# EAGLE design FullInstrument (EAGLE 7.4.0)
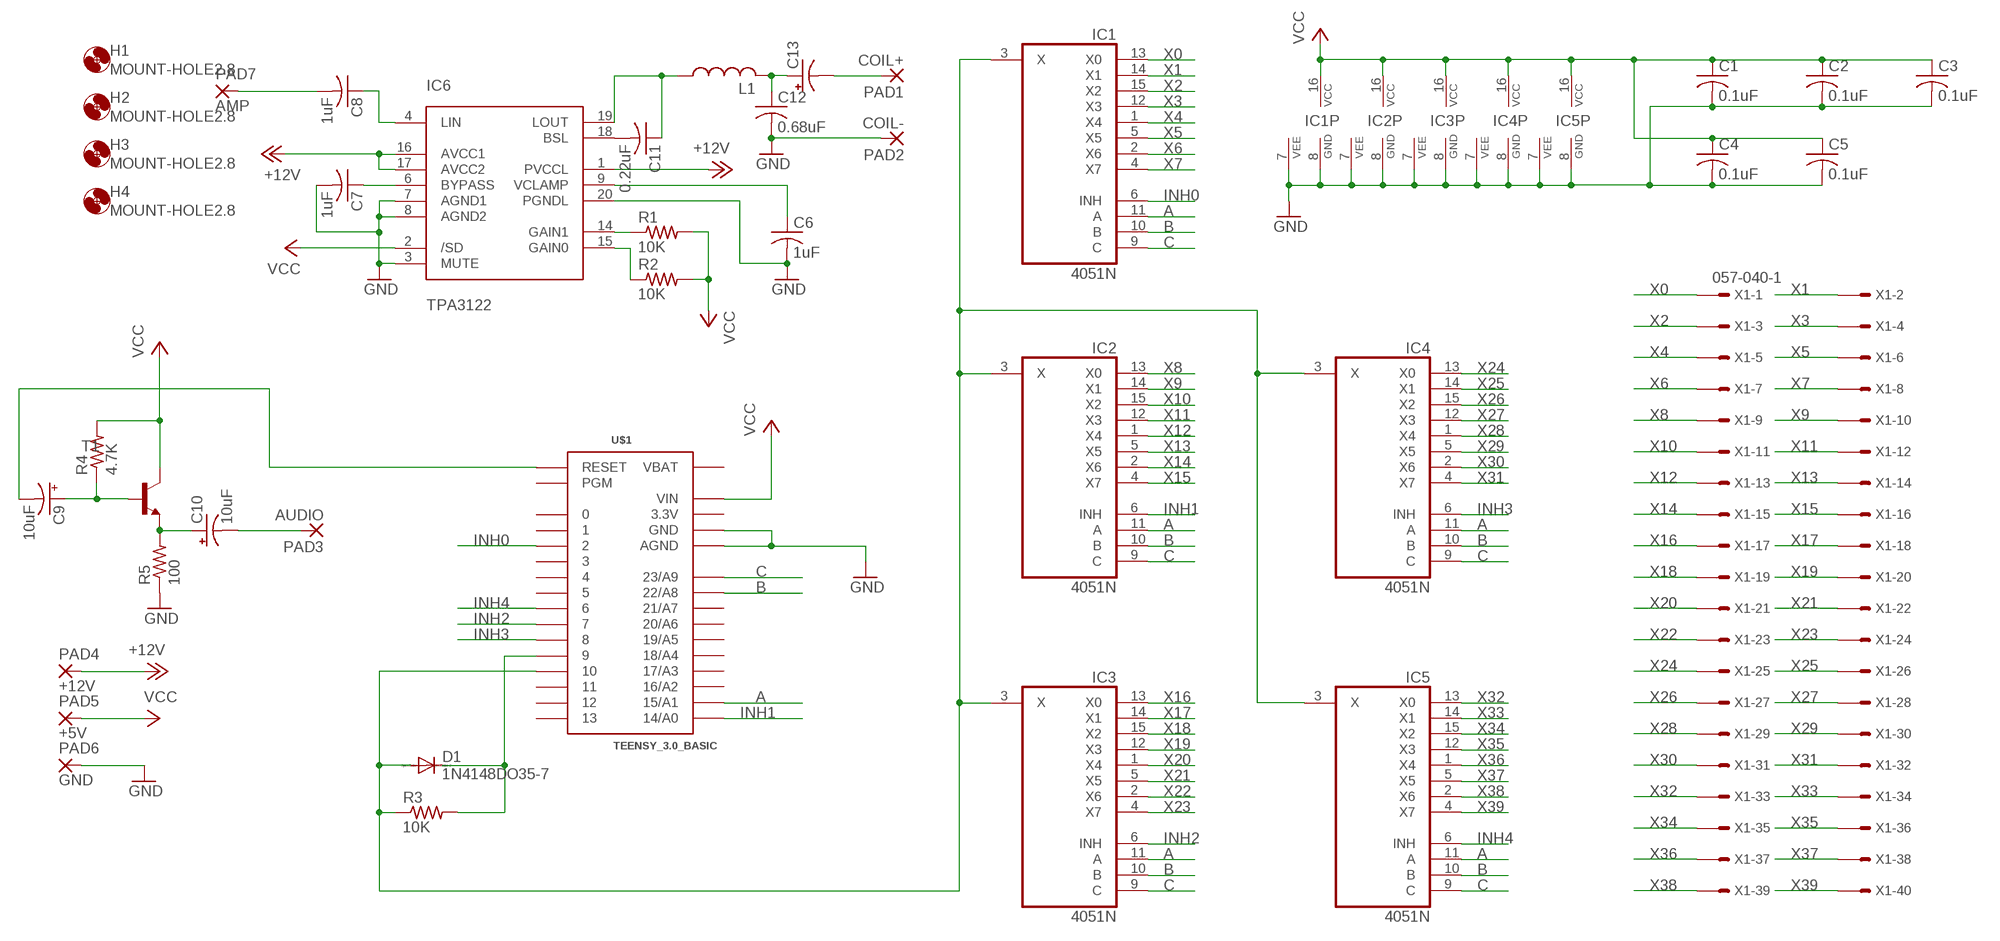
[diagram p0: schematic, sheet 1]

## Parts
C1  0.1uF  C-US025-025X050  [C025-025X050]
C2  0.1uF  C-US025-025X050  [C025-025X050]
C3  0.1uF  C-US025-025X050  [C025-025X050]
C4  0.1uF  C-US025-025X050  [C025-025X050]
C5  0.1uF  C-US025-025X050  [C025-025X050]
C6  1uF  C-US050-025X075  [C050-025X075]
C7  1uF  C-US050-025X075  [C050-025X075]
C8  1uF  C-US050-025X075  [C050-025X075]
C9  10uF  CPOL-USE2-5  [E2-5]
C10  10uF  CPOL-USE2-5  [E2-5]
C11  0.22uF  C-US050-025X075  [C050-025X075]
C12  0.68uF  C-US050-025X075  [C050-025X075]
C13  CPOL-USE5-8.5  [E5-8,5]
D1  1N4148DO35-7  [DO35-7]
H1  MOUNT-HOLE2.8  [2,8]
H2  MOUNT-HOLE2.8  [2,8]
H3  MOUNT-HOLE2.8  [2,8]
H4  MOUNT-HOLE2.8  [2,8]
IC1  4051N  [DIL16]
IC2  4051N  [DIL16]
IC3  4051N  [DIL16]
IC4  4051N  [DIL16]
IC5  4051N  [DIL16]
IC6  TPA3122  [TPA3122-DIP20]
L1  L-US6000-XXX-RC  [6000-XXXX-RC]
PAD1  COIL+  3,17/1,3  [3,17/1,3]
PAD2  COIL-  3,17/1,3  [3,17/1,3]
PAD3  AUDIO  3,17/1,3  [3,17/1,3]
PAD4  +12V  3,17/1,3  [3,17/1,3]
PAD5  +5V  3,17/1,3  [3,17/1,3]
PAD6  GND  3,17/1,3  [3,17/1,3]
PAD7  AMP  3,17/1,3  [3,17/1,3]
R1  10K  R-US_0204/2V  [0204V]
R2  10K  R-US_0204/2V  [0204V]
R3  10K  R-US_0204/2V  [0204V]
R4  4.7K  R-US_0204/2V  [0204V]
R5  100  R-US_0204/2V  [0204V]
T1  -NPN-TO92-EBC  [TO92-EBC]
U$1  TEENSY_3.0_BASIC  [TEENSY_3.0_BASIC]
X1  057-040-1  [057-040-1]

## Nets
+12V: IC6.1(PVCCL) IC6.16(AVCC1) IC6.17(AVCC2) PAD4.1(P)
A: IC1.11(A) IC2.11(A) IC3.11(A) IC4.11(A) IC5.11(A) U$1.15/A1
B: IC1.10(B) IC2.10(B) IC3.10(B) IC4.10(B) IC5.10(B) U$1.22/A8
C: IC1.9(C) IC2.9(C) IC3.9(C) IC4.9(C) IC5.9(C) U$1.23/A9
GND [ground]: C1.2 C2.2 C3.2 C4.2 C5.2 C6.2 C7.2 C12.2 IC1.7(VEE) IC1.8(GND) IC2.7(VEE) IC2.8(GND) IC3.7(VEE) IC3.8(GND) IC4.7(VEE) IC4.8(GND) IC5.7(VEE) IC5.8(GND) IC6.3(MUTE) IC6.7(AGND1) IC6.8(AGND2) IC6.20(PGNDL) PAD2.1(P) PAD6.1(P) R5.1 U$1.AGND U$1.GND U$1.GND1(GND)
INH0: IC1.6(INH) U$1.2
INH1: IC2.6(INH) U$1.14/A0
INH2: IC3.6(INH) U$1.7
INH3: IC4.6(INH) U$1.8
INH4: IC5.6(INH) U$1.6
N$1: IC6.14(GAIN1) R1.1
N$2: C11.2 IC6.18(BSL)
N$3: IC6.15(GAIN0) R2.1
N$4: C8.1 IC6.4(LIN)
N$5: C7.1 IC6.6(BYPASS)
N$6: C6.1 IC6.9(VCLAMP)
N$7: R3.2 U$1.9
N$8: D1.A IC1.3(X) IC2.3(X) IC3.3(X) IC4.3(X) IC5.3(X) R3.1 U$1.10
N$9: C10.+ R5.2 T1.E
N$10: C9.+ R4.1 T1.B
N$11: C11.1 IC6.19(LOUT) L1.1
N$12: C9.- U$1.RESET
N$13: C12.1 C13.+ L1.2
N$14: C13.- PAD1.1(P)
N$15: C10.- PAD3.1(P)
N$16: C8.2 PAD7.1(P)
VCC [ground]: C1.1 C2.1 C3.1 C4.1 C5.1 IC1.16(VCC) IC2.16(VCC) IC3.16(VCC) IC4.16(VCC) IC5.16(VCC) IC6.2(/SD) PAD5.1(P) R1.2 R2.2 R4.2 T1.C U$1.VIN
X0: IC1.13(X0) X1.1
X1: IC1.14(X1) X1.2
X2: IC1.15(X2) X1.3
X3: IC1.12(X3) X1.4
X4: IC1.1(X4) X1.5
X5: IC1.5(X5) X1.6
X6: IC1.2(X6) X1.7
X7: IC1.4(X7) X1.8
X8: IC2.13(X0) X1.9
X9: IC2.14(X1) X1.10
X10: IC2.15(X2) X1.11
X11: IC2.12(X3) X1.12
X12: IC2.1(X4) X1.13
X13: IC2.5(X5) X1.14
X14: IC2.2(X6) X1.15
X15: IC2.4(X7) X1.16
X16: IC3.13(X0) X1.17
X17: IC3.14(X1) X1.18
X18: IC3.15(X2) X1.19
X19: IC3.12(X3) X1.20
X20: IC3.1(X4) X1.21
X21: IC3.5(X5) X1.22
X22: IC3.2(X6) X1.23
X23: IC3.4(X7) X1.24
X24: IC4.13(X0) X1.25
X25: IC4.14(X1) X1.26
X26: IC4.15(X2) X1.27
X27: IC4.12(X3) X1.28
X28: IC4.1(X4) X1.29
X29: IC4.5(X5) X1.30
X30: IC4.2(X6) X1.31
X31: IC4.4(X7) X1.32
X32: IC5.13(X0) X1.33
X33: IC5.14(X1) X1.34
X34: IC5.15(X2) X1.35
X35: IC5.12(X3) X1.36
X36: IC5.1(X4) X1.37
X37: IC5.5(X5) X1.38
X38: IC5.2(X6) X1.39
X39: IC5.4(X7) X1.40
Unconnected: D1.C U$1.0 U$1.1 U$1.3 U$1.4 U$1.5 U$1.11 U$1.12 U$1.13 U$1.16/A2 U$1.17/A3 U$1.18/A4 U$1.19/A5 U$1.20/A6 U$1.21/A7 U$1.PGM

## Power pins joined to a net without a drawn wire
3.3V: U$1.3.3V U$1.3.3V1(3.3V)
VBAT: U$1.VBAT

## Library data of the parts
C1-C8 C11 C12 = rcl:C-US: CAPACITOR, American symbol
C9 C10 C13 = rcl:CPOL-US: POLARIZED CAPACITOR, American symbol
D1 = diode:1N4148: DIODE high speed (Philips)
H1-H4 = holes:MOUNT-HOLE: MOUNTING HOLE with drill center marker
IC1-IC5 = 40xx:4051: 8-channel ANALOG MULTIPLEXER
IC6 = tpa3122:TPA3122
L1 = rcl:L-US: INDUCTOR, American symbol
PAD1-PAD7 = wirepad:3,17/1,3: THROUGH-HOLE PAD
R1-R5 = rcl:R-US_: RESISTOR, American symbol
T1 = transistor:*-NPN-: NPN Transistror BF959 corrected 2008.03.06
U$1 = Teensy3.0:TEENSY_3.0_BASIC: Basic Teensy 3.0 with none of the 'inner' pins enabled. See '+4', 'AllAnalogPins", and 'AllPins' packages for additional pin holes, as needed.
X1 = con-panduit:057-040-: CONNECTOR 40-pin series 057 contact pc board low profile headers; OC_FARNELL: unknown; OC_NEWARK: unknown

## Net classes
0 default: width 0.203 mm
1 ground: width 0.406 mm

## Board
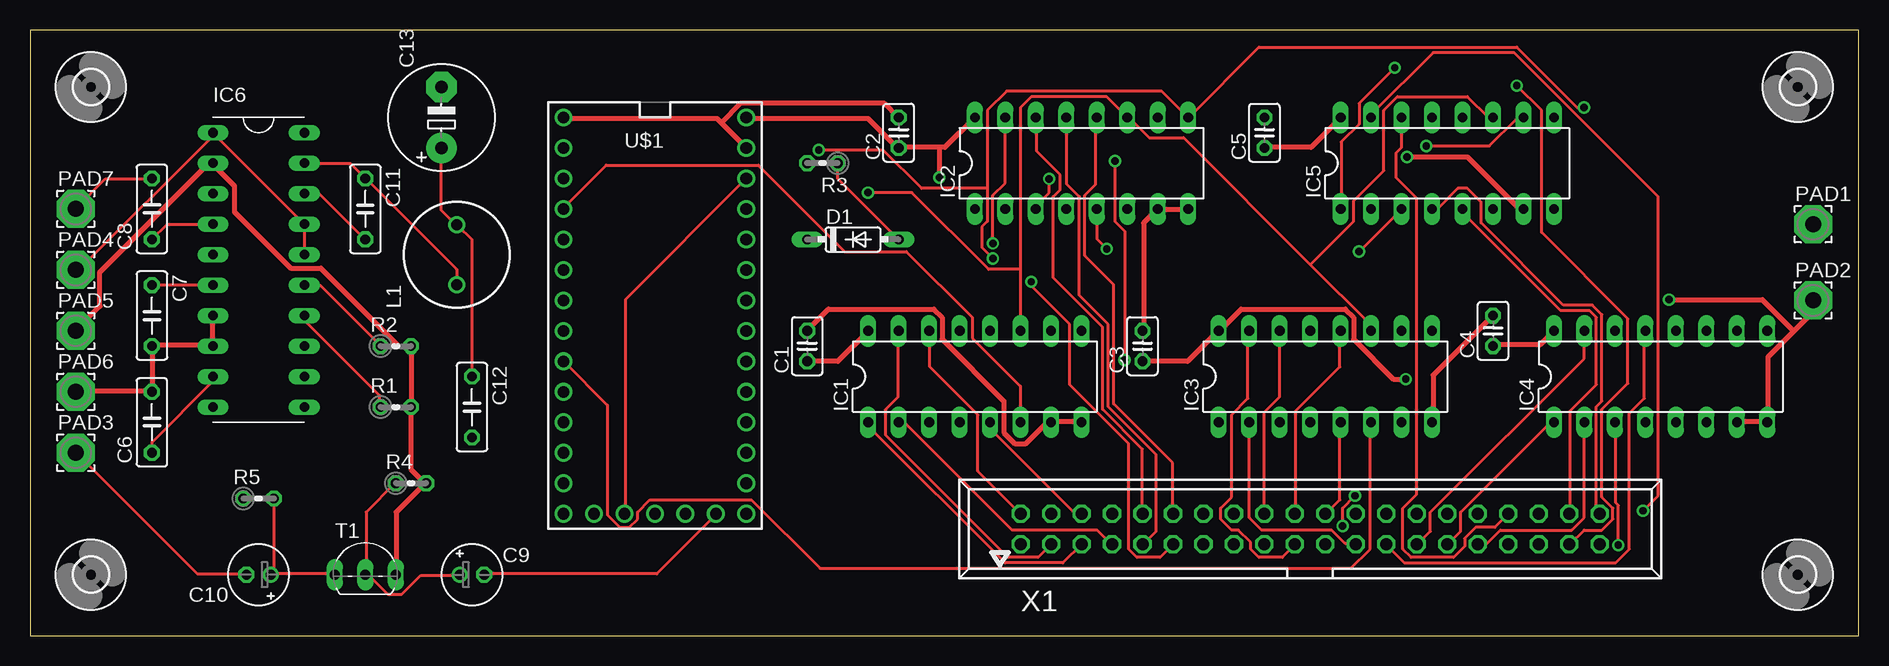
[diagram p1: board, top side]
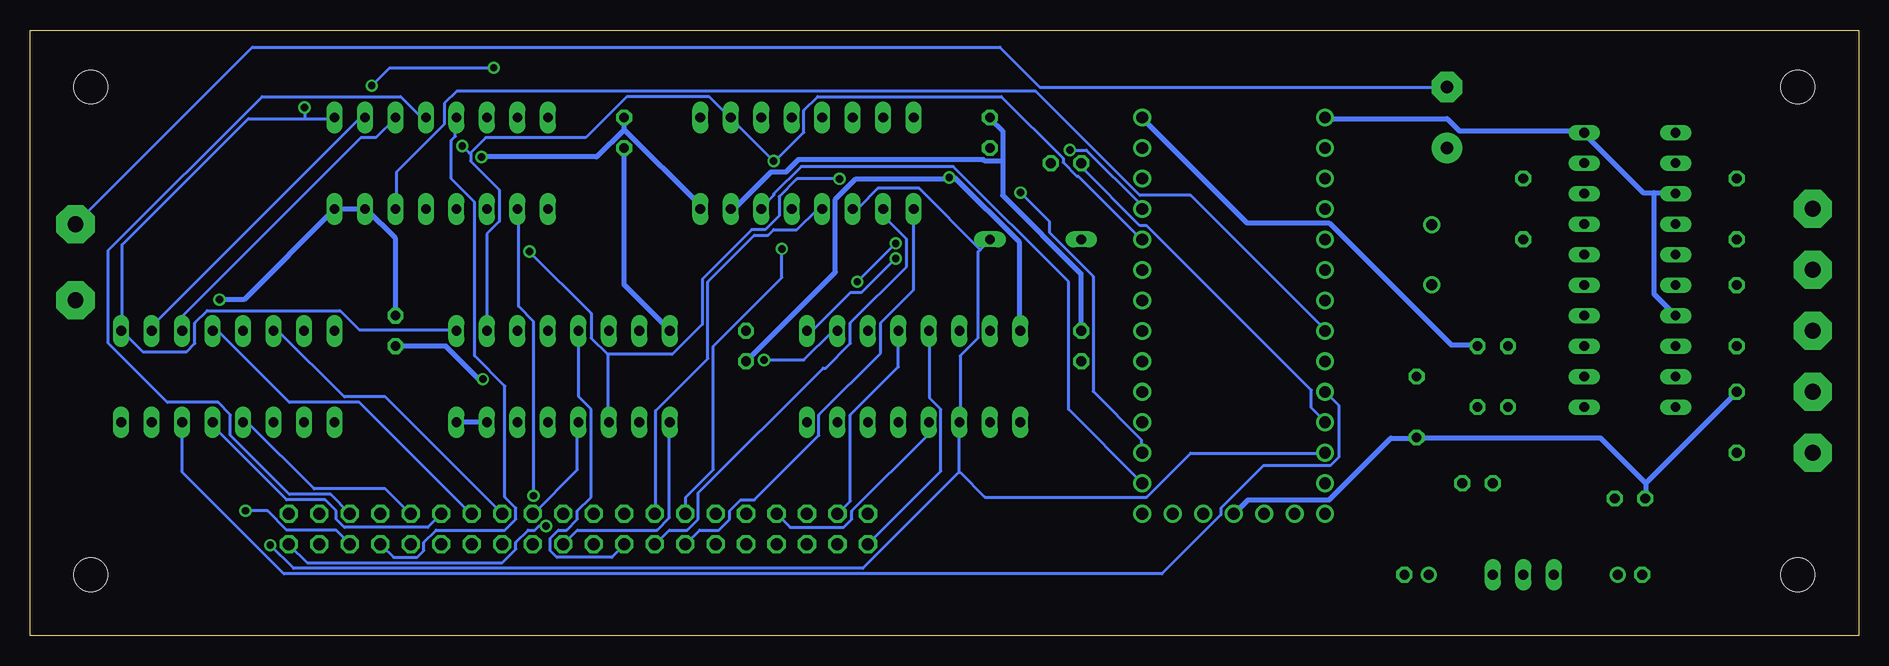
[diagram p2: board, bottom side, seen from below]

Size 152.38 x 50.47 mm. Coordinates in mm from the lower left corner, seen from the top.
Outline: 0,0 152.38,0 152.38,50.47 0,50.47 0,0
Copper layers (1*16): Top 0.035mm / dielectric 1.5mm / Bottom 0.035mm
Design rules "default": minimum track width 10mil, minimum drill 24mil, track to track 8mil, track to pad 8mil, pad to pad 8mil, via to via 8mil, smd to smd 8mil, copper to edge 40mil, drill to drill 8mil, minimum pad ring 10mil, minimum via ring 8mil, stop-mask expansion 4mil, vias tented up to drill 0mil, thermal gap 10mil

### Footprints (pad centres in the part's own frame; a part is rotated, then mirrored left to right if it is on the bottom)
C025-025X050 = drill 0.813 octagon: 1 -1.27,0; 2 1.27,0
C050-025X075 = drill 0.813 octagon: 1 -2.54,0; 2 2.54,0
E2-5 = drill 0.813 pad 1.27: + -1.016,0 | drill 0.813 pad 1.27 octagon: - 1.016,0
E5-8,5 = drill 1.016 pad 2.54: + -2.54,0 | drill 1.016 pad 2.54 octagon: - 2.54,0
DO35-7 = drill 0.813 long: A 3.81,0; C -3.81,0
2,8 = hole 2.8: 0,0
DIL16 = drill 0.813 long: 1 -8.89,-3.81; 2 -6.35,-3.81; 3 -3.81,-3.81; 4 -1.27,-3.81; 5 1.27,-3.81; 6 3.81,-3.81; 7 6.35,-3.81; 8 8.89,-3.81; 9 8.89,3.81; 10 6.35,3.81; 11 3.81,3.81; 12 1.27,3.81; 13 -1.27,3.81; 14 -3.81,3.81; 15 -6.35,3.81; 16 -8.89,3.81
TPA3122-DIP20 = drill 0.8 long: 1 -3.81,11.43; 2 -3.81,8.89; 3 -3.81,6.35; 4 -3.81,3.81; 5 -3.81,1.27; 6 -3.81,-1.27; 7 -3.81,-3.81; 8 -3.81,-6.35; 9 -3.81,-8.89; 10 -3.81,-11.43; 11 3.81,-11.43; 12 3.81,-8.89; 13 3.81,-6.35; 14 3.81,-3.81; 15 3.81,-1.27; 16 3.81,1.27; 17 3.81,3.81; 18 3.81,6.35; 19 3.81,8.89; 20 3.81,11.43
6000-XXXX-RC = drill 0.9 pad 1.422: 1 -2.5,0; 2 2.5,0
3,17/1,3 = drill 1.321 pad 3.175 octagon: 1 0,0
0204V = drill 0.813 octagon: 1 -1.27,0; 2 1.27,0
TO92-EBC = drill 0.813 long: B 0,-1.27; C 2.54,-1.27; E -2.54,-1.27
TEENSY_3.0_BASIC = drill 0.965: 0 -7.62,13.97; 1 -7.62,11.43; 2 -7.62,8.89; 3 -7.62,6.35; 3.3V 7.62,11.43; 3.3V1 -2.54,-16.51; 4 -7.62,3.81; 5 -7.62,1.27; 6 -7.62,-1.27; 7 -7.62,-3.81; 8 -7.62,-6.35; 9 -7.62,-8.89; 10 -7.62,-11.43; 11 -7.62,-13.97; 12 -7.62,-16.51; 13 7.62,-16.51; 14/A0 7.62,-13.97; 15/A1 7.62,-11.43; 16/A2 7.62,-8.89; 17/A3 7.62,-6.35; 18/A4 7.62,-3.81; 19/A5 7.62,-1.27; 20/A6 7.62,1.27; 21/A7 7.62,3.81; 22/A8 7.62,6.35; 23/A9 7.62,8.89; AGND 7.62,13.97; GND -7.62,16.51; GND1 0,-16.51; PGM 2.54,-16.51; RESET 5.08,-16.51; VBAT -5.08,-16.51; VIN 7.62,16.51
057-040-1 = drill 1 octagon: 1 -24.13,-1.27; 2 -24.13,1.27; 3 -21.59,-1.27; 4 -21.59,1.27; 5 -19.05,-1.27; 6 -19.05,1.27; 7 -16.51,-1.27; 8 -16.51,1.27; 9 -13.97,-1.27; 10 -13.97,1.27; 11 -11.43,-1.27; 12 -11.43,1.27; 13 -8.89,-1.27; 14 -8.89,1.27; 15 -6.35,-1.27; 16 -6.35,1.27; 17 -3.81,-1.27; 18 -3.81,1.27; 19 -1.27,-1.27; 20 -1.27,1.27; 21 1.27,-1.27; 22 1.27,1.27; 23 3.81,-1.27; 24 3.81,1.27; 25 6.35,-1.27; 26 6.35,1.27; 27 8.89,-1.27; 28 8.89,1.27; 29 11.43,-1.27; 30 11.43,1.27; 31 13.97,-1.27; 32 13.97,1.27; 33 16.51,-1.27; 34 16.51,1.27; 35 19.05,-1.27; 36 19.05,1.27; 37 21.59,-1.27; 38 21.59,1.27; 39 24.13,-1.27; 40 24.13,1.27

### Placement (x,y rotation side)
C1  64.77,24.13 90 top
C2  72.39,41.91 90 top
C3  92.71,24.13 90 top
C4  121.92,25.4 90 top
C5  102.87,41.91 90 top
C6  10.16,17.78 90 top
C7  10.16,26.67 270 top
C8  10.16,35.56 90 top
C9  36.83,5.08 0 top
C10  19.05,5.08 180 top
C11  27.94,35.56 270 top
C12  36.83,19.05 270 top
C13  34.29,43.18 90 top
D1  68.58,33.02 0 top
H1  5.08,45.72 0 top
H2  147.32,5.08 0 top
H3  147.32,45.72 0 top
H4  5.08,5.08 0 top
IC1  78.74,21.59 0 top
IC2  87.63,39.37 0 top
IC3  107.95,21.59 0 top
IC4  135.89,21.59 0 top
IC5  118.11,39.37 0 top
IC6  19.05,30.48 0 top
L1  35.56,31.75 90 top
PAD1  148.59,34.29 0 top
PAD2  148.59,27.94 0 top
PAD3  3.81,15.24 0 top
PAD4  3.81,30.48 0 top
PAD5  3.81,25.4 0 top
PAD6  3.81,20.32 0 top
PAD7  3.81,35.56 0 top
R1  30.48,19.05 0 top
R2  30.48,24.13 0 top
R3  66.04,39.37 180 top
R4  31.75,12.7 0 top
R5  19.05,11.43 0 top
T1  27.94,6.35 0 top
U$1  52.07,26.67 0 top
X1  106.68,8.89 0 top

### Tracks (layer width: path | path; a pad name or v marks a point on that pad's centre or on a via)
3.3V
  Top 0.254: U$1.3.3V1 49.61,10.17 49.61,28 59.66,38.06 U$1.3.3V
+12V
  Top 0.254: IC6.16 IC6.17 IC6.1 15.32,41.72 4.12,30.52 3.89,30.52 PAD4.1
A  (via drill 0.61)
  Top 0.254: 82.53,30.52 82.53,44.01 83.44,44.92 89.72,44.92 91.44,43.2 IC2.11 91.55,43.2 93.27,41.49 96.13,41.49 106.7,30.92 | 82.53,30.52 82.53,25.49 IC1.11 | 106.7,30.92 111.67,25.95 111.67,25.49 IC3.11 | 106.7,30.92 110.3,34.52 110.3,36.23 112.81,38.75 112.81,43.78 113.96,44.92 119.79,44.92 121.5,43.2 121.84,43.2 IC5.11 | v69.84,36.92 73.5,36.92 79.9,30.52 82.53,30.52
  Bottom 0.254: IC4.11 139.68,25.49 139.68,26.63 124.82,41.49 123.56,41.49 121.96,43.09 IC5.11 | v69.84,36.92 67.44,34.52 67.44,33.6 63.78,29.95 63.78,20.34 59.78,16.34 59.78,15.32 U$1.15/A1
B  (via drill 0.61)
  Top 0.254: v91.21,22.97 91.21,33.72 90.41,34.52 v90.41,39.55 | v116.36,40.8 121.61,40.8 123.9,43.09 124.36,43.09 IC5.10
  Bottom 0.254: IC5.10 124.47,43.09 124.93,43.09 142.19,25.83 142.19,25.49 IC4.10 | v91.21,22.97 87.9,22.97 85.5,25.38 85.15,25.38 IC1.10 | IC3.10 114.3,33.49 113.27,34.52 113.27,37.15 115.67,39.55 115.67,40.23 | 115.67,40.23 114.41,41.49 106.07,41.49 102.64,44.92 95.78,44.92 94.07,43.2 IC2.10 93.95,43.09 v90.41,39.55 90.3,39.55 87.9,41.95 87.9,43.78 86.75,44.92 71.44,44.92 66.29,39.78 66.29,39.43 65.15,38.29 65.04,38.29 59.78,33.03 U$1.22/A8 | v116.36,40.8 115.79,40.23 115.67,40.23
C  (via drill 0.61)
  Top 0.254: v80.24,31.43 79.32,32.35 79.32,34.06 79.78,34.52 79.78,37.26 | 79.78,37.26 79.78,43.78 81.38,45.38 94.3,45.38 96.47,43.2 IC2.9 96.58,43.2 102.41,49.03 123.9,49.03 128.93,44.01 v129.5,44.01 | v65.72,40.46 71.09,40.46 74.3,37.26 79.78,37.26
  Bottom 0.254: IC3.9 116.93,25.49 124.93,25.49 126.53,27.09 137.62,27.09 138.65,26.06 138.65,24.35 139.33,23.66 142.99,23.66 144.7,25.38 IC4.9 144.7,25.49 144.7,32.58 134.19,43.09 129.5,43.09 | 129.5,43.09 127.1,43.09 IC5.9 | v80.24,31.43 83.1,28.57 84.01,28.57 87.1,25.49 87.55,25.49 IC1.9 | v65.72,40.46 64.35,40.46 59.78,35.89 59.78,35.66 U$1.23/A9 | v129.5,44.01 129.5,43.09
GND  (via drill 0.61)
  Top 0.406: IC6.7 15.2,26.63 15.2,24.23 IC6.8 15.09,24.23 10.29,24.23 C7.2 10.17,24.12 10.17,20.34 C6.2 10.06,20.34 3.89,20.34 PAD6.1 | IC4.7 142.3,17.83 144.7,17.83 IC4.8 144.82,17.95 144.82,23.2 146.99,25.38 | 146.99,25.38 148.59,26.98 PAD2.1 | IC3.8 116.93,17.83 116.93,21.72 121.84,26.63 C4.2 | 146.99,25.38 144.36,28 v136.59,28 | C3.2 92.81,25.49 92.81,34.4 93.95,35.55 IC2.7 94.18,35.55 96.47,35.55 IC2.8 | 57.61,42.75 59.66,40.69 U$1.AGND | 57.61,42.75 57.26,43.09 44.46,43.09 U$1.GND | IC1.8 87.55,17.83 85.15,17.83 IC1.7 84.92,17.72 84.7,17.72 82.98,16 82.07,16 81.15,16.92 81.15,19.55 76.01,24.69 76.01,26.52 75.32,27.2 66.52,27.2 64.81,25.49 C1.2 | 57.61,42.75 59.21,44.35 71.21,44.35 72.35,43.2 C2.2 | v114.76,39.89 119.79,39.89 124.02,35.66 124.36,35.66 IC5.7
  Bottom 0.406: U$1.GND1 52.01,10.17 50.86,11.32 44.12,11.32 38.98,16.46 36.92,16.46 C12.2 36.69,16.46 21.49,16.46 17.72,12.69 | 17.03,36.92 17.95,36.92 22.86,41.83 IC6.20 22.97,42.06 33.26,42.06 34.29,43.09 44.35,43.09 U$1.GND | 17.03,36.92 15.32,36.92 IC6.3 | 17.72,12.69 17.72,11.43 R5.1 | 17.72,12.69 10.17,20.23 C6.2 | 17.03,36.92 17.03,28.46 IC6.7 | IC3.7 114.3,17.83 116.81,17.83 IC3.8 | C4.2 121.96,26.75 121.96,33.15 124.36,35.55 IC5.7 124.59,35.55 126.99,35.55 IC5.8 127.1,35.43 134.53,28 v136.59,28 | 102.87,42.18 C5.2 | 102.87,42.18 96.58,35.89 96.58,35.66 IC2.8 | 71.32,39.55 71.32,42.06 72.35,43.09 C2.2 | 71.32,39.55 71.32,36.69 64.81,30.18 64.81,25.49 C1.2 | 71.32,39.55 72.81,39.55 72.92,39.66 88.35,39.66 89.38,38.63 90.64,38.63 93.61,35.66 93.95,35.66 IC2.7 | v114.76,39.89 105.16,39.89 102.87,42.18
INH0
  Top 0.254: IC1.6 82.53,17.83 82.53,20.8 78.52,24.8 78.52,26.52 73.04,32 67.89,32 60.69,39.2 48.01,39.2 44.46,35.66 U$1.2
INH1
  Bottom 0.254: IC2.6 91.44,35.66 90.41,36.69 90.41,36.8 88.12,39.09 75.44,39.09 65.84,29.49 65.84,18.86 59.78,12.8 U$1.14/A0
INH2
  Top 0.254: IC3.6 111.67,17.72 111.67,7.2 110.07,5.6 65.84,5.6 60.12,11.32 51.66,11.32 50.63,10.29 50.63,9.72 49.95,9.03 49.15,9.03 48.12,10.06 48.12,19.2 44.46,22.86 U$1.7
INH3
  Bottom 0.254: IC4.6 139.68,17.72 139.68,13.6 131.22,5.14 58.06,5.14 53.15,10.06 53.15,10.63 49.61,14.17 44.01,14.17 43.32,14.86 43.32,19.2 44.35,20.23 U$1.8
INH4
  Bottom 0.254: IC5.6 121.84,35.66 121.84,38.63 117.84,42.63 117.84,44.35 116.81,45.38 68.58,45.38 59.89,36.69 55.66,36.69 44.46,25.49 U$1.6
N$1
  Top 0.254: IC6.14 22.86,26.29 29.15,20 29.15,19.09 R1.1
N$2
  Top 0.254: IC6.18 22.86,36.8 24.12,36.8 27.89,33.03 C11.2
N$3
  Top 0.254: IC6.15 22.86,29.15 24.23,29.15 29.15,24.23 R2.1
N$4
  Top 0.254: IC6.4 11.43,34.29 C8.1
N$5
  Top 0.254: IC6.6 15.2,29.26 10.17,29.26 C7.1
N$6
  Top 0.254: IC6.9 15.2,21.49 15.2,21.14 10.17,16.12 10.17,15.32 C6.1
N$7
  Bottom 0.254: R3.2 64.69,39.32 64.69,38.98 59.89,34.18 59.32,34.18 45.61,20.46 45.61,18.97 44.46,17.83 U$1.9
N$8  (via drill 0.61)
  Top 0.254: v110.76,32 114.3,35.55 IC5.3 | v132.36,7.54 132.36,10.86 132.13,11.09 132.13,17.72 IC4.3 | R3.1 67.32,39.32 67.32,38.06 72.35,33.03 D1.A | v84.92,38.06 84.92,36.92 83.9,35.89 83.9,35.66 IC2.3
  Bottom 0.254: 104.24,23.43 104.24,17.83 IC3.3 | 104.24,23.43 105.61,24.8 105.61,26.86 v110.76,32 | 73.21,32.17 72.47,32.92 D1.A | 73.21,32.17 73.38,32 73.38,24.8 74.87,23.32 74.87,17.83 IC1.3 74.98,17.72 74.98,13.6 | v132.36,7.54 130.42,5.6 82.98,5.6 74.98,13.6 | 73.21,32.17 78.3,37.26 81.72,37.26 83.33,35.66 83.78,35.66 IC2.3 | U$1.10 44.46,15.2 55.66,15.2 59.32,11.54 72.81,11.54 74.87,13.6 74.98,13.6 | 104.24,23.43 98.87,23.43 96.36,25.95 96.36,29.72 92.24,33.83 91.1,33.83 89.95,34.98 89.95,36.58 88.47,38.06 v84.92,38.06
N$9
  Top 0.254: T1.E 25.38,5.14 20.12,5.14 C10.+ 20.34,5.26 20.34,11.43 R5.2
N$10
  Top 0.254: R4.1 30.4,12.69 28,10.29 28,5.14 T1.B 28.12,5.14 29.83,3.43 30.98,3.43 32.58,5.03 35.78,5.03 C9.+
N$11
  Top 0.254: IC6.19 22.86,39.32 26.75,39.32 27.89,38.18 C11.1 28,38.06 35.55,30.52 35.55,29.26 L1.1
N$12
  Top 0.254: C9.- 37.95,5.14 52.23,5.14 57.15,10.06 U$1.RESET
N$13
  Top 0.254: C12.1 36.8,21.6 36.8,33.03 35.66,34.18 L1.2 35.43,34.29 34.29,35.43 C13.+
N$14
  Bottom 0.254: C13.- 68.24,45.72 71.55,49.03 133.84,49.03 PAD1.1
N$15
  Top 0.254: C10.- 17.95,5.14 13.95,5.14 3.89,15.2 PAD3.1
N$16
  Top 0.254: C8.2 10.06,38.06 6.29,38.06 3.89,35.66 PAD7.1
VCC  (via drill 0.61)
  Top 0.406: T1.C 30.52,5.14 30.52,10.29 32.92,12.69 R4.2 32.8,12.8 31.77,13.83 31.77,18.86 R1.2 31.77,19.09 31.77,24.12 R2.2 31.55,24.12 30.75,24.12 24.23,30.63 21.72,30.63 17.03,35.32 17.03,37.49 15.32,39.2 IC6.2 15.2,39.32 14.86,39.32 5.83,30.29 5.83,27.43 3.89,25.49 PAD5.1 | C1.1 67.32,22.86 69.84,25.38 IC1.16 | 75.78,40.69 76.24,40.69 78.64,43.09 IC2.16 | 75.78,40.69 72.47,40.69 C2.1 72.24,40.69 69.84,43.09 59.78,43.09 U$1.VIN | 75.78,40.69 v75.78,38.18 | C5.1 102.87,40.69 106.76,40.69 109.16,43.09 IC5.16 | C4.1 121.96,24.23 125.84,24.23 126.99,25.38 IC4.16 | C3.1 96.47,22.86 98.98,25.38 IC3.16 99.21,25.49 100.93,27.2 109.61,27.2 110.3,26.52 110.3,24.69 113.61,21.37 v114.64,21.37
  Bottom 0.406: IC1.16 69.95,25.49 69.95,32.8 75.32,38.18 v75.78,38.18 75.89,38.06 83.55,38.06 85.27,36.35 85.27,30.29 92.7,22.86 C3.1 | v114.64,21.37 114.99,21.37 117.73,24.12 121.84,24.12 C4.1 | C5.1 102.87,29.26 99.1,25.49 IC3.16 | R2.2 31.77,24.23 33.95,24.23 44.12,34.4 50.98,34.4 59.66,43.09 U$1.VIN
X0
  Bottom 0.254: IC1.13 77.38,25.38 77.38,19.77 76.47,18.86 76.47,13.72 82.53,7.66 X1.1
X1
  Top 0.254: IC1.14 74.98,25.38 74.98,22.4 78.98,18.4 78.98,13.72 82.53,10.17 X1.2
X2
  Top 0.254: IC1.15 72.35,25.38 72.35,19.89 71.32,18.86 71.32,16.69 81.5,6.51 84.01,6.51 85.04,7.54 X1.3
X3
  Bottom 0.254: IC1.12 80.01,22.4 84.01,18.4 84.01,11.2 85.04,10.17 X1.4
X4
  Top 0.254: X1.5 86.07,6.06 81.27,6.06 69.95,17.37 69.95,17.72 IC1.1
X5
  Top 0.254: IC1.5 80.01,17.26 87.1,10.17 87.55,10.17 X1.6
X6
  Top 0.254: IC1.2 72.47,17.72 72.92,17.72 81.84,8.8 88.92,8.8 90.07,7.66 X1.7
X7
  Bottom 0.254: X1.8 89.04,9.03 84.58,9.03 83.9,9.72 83.9,10.4 77.5,16.8 77.5,17.72 IC1.4
X8
  Top 0.254: IC2.13 86.41,43.09 86.41,37.6 87.44,36.58 87.44,28.35 89.84,25.95 89.84,19.09 93.84,15.09 93.84,8.69 92.81,7.66 X1.9
X9
  Top 0.254: IC2.14 83.9,43.09 83.9,40.35 85.84,38.41 85.84,37.15 85.27,36.58 85.27,29.83 89.38,25.72 89.38,18.86 92.7,15.54 92.7,10.17 X1.10
X10  (via drill 0.61)
  Top 0.254: v80.24,32.69 80.24,36.69 81.27,37.72 81.27,43.09 IC2.15 | v83.44,29.49 83.44,29.15 86.64,25.95 86.64,20.92 91.55,16 91.55,7.2 92.24,6.51 94.18,6.51 95.21,7.54 X1.11
  Bottom 0.254: v83.44,29.49 v80.24,32.69
X11
  Top 0.254: IC2.12 88.81,43.09 88.81,37.6 87.9,36.69 87.9,31.66 90.3,29.26 90.3,19.32 95.21,14.4 95.21,10.17 X1.12
X12
  Bottom 0.254: IC2.1 78.75,35.55 78.75,28.8 81.5,26.06 81.5,23.55 86.64,18.4 86.64,16.69 92.01,11.32 93.15,11.32 94.07,10.4 94.07,9.72 94.98,8.8 96.58,8.8 97.73,7.66 X1.13
X13  (via drill 0.61)
  Top 0.254: v89.72,32.23 88.92,33.03 88.92,35.55 IC2.5
  Bottom 0.254: v89.72,32.23 89.72,29.83 95.44,24.12 95.44,13.83 97.73,11.54 97.73,10.17 X1.14
X14
  Bottom 0.254: IC2.2 81.27,35.55 81.27,34.98 79.32,33.03 79.32,30.75 84.01,26.06 84.01,24.35 86.07,22.29 86.3,22.29 96.7,11.89 96.7,9.72 97.61,8.8 99.1,8.8 100.24,7.66 X1.15
X15
  Bottom 0.254: IC2.4 86.41,35.55 86.75,35.55 88.47,33.83 90.41,33.83 90.87,33.38 92.01,33.38 95.9,29.49 95.9,23.09 100.24,18.75 100.24,10.17 X1.16
X16
  Bottom 0.254: IC3.13 106.64,25.38 106.64,19.89 105.61,18.86 105.61,11.54 106.76,10.4 106.76,9.72 107.67,8.8 108.36,8.8 109.04,8.12 109.04,7.09 108.47,6.51 103.9,6.51 102.87,7.54 X1.17
X17
  Top 0.254: X1.18 102.87,18.63 104.13,19.89 104.13,25.38 IC3.14
X18
  Top 0.254: IC3.15 101.5,25.38 101.5,19.77 100.13,18.4 100.13,11.54 99.21,10.63 99.21,9.72 100.13,8.8 100.7,8.8 101.73,7.77 101.73,7.2 102.41,6.51 104.36,6.51 105.39,7.54 X1.19
X19
  Top 0.254: IC3.12 109.16,25.38 109.16,22.4 105.5,18.75 105.5,10.17 X1.20
X20
  Bottom 0.254: IC3.1 99.1,17.72 99.1,9.83 100.13,8.8 106.76,8.8 107.9,7.66 X1.21
X21
  Top 0.254: IC3.5 109.16,17.72 109.16,11.32 108.01,10.17 X1.22
X22
  Top 0.254: IC3.2 101.61,17.72 101.61,9.83 102.64,8.8 108.47,8.8 109.61,7.66 110.41,7.66 X1.23
X23
  Bottom 0.254: IC3.4 106.76,17.72 106.76,13.83 110.41,10.17 X1.24
X24
  Top 0.254: IC4.13 134.53,25.38 134.53,19.77 133.27,18.52 133.27,7.2 132.13,6.06 114.53,6.06 113.04,7.54 X1.25
X25
  Bottom 0.254: X1.26 122.76,19.89 126.19,19.89 131.67,25.38 132.02,25.38 IC4.14
X26
  Top 0.254: IC4.15 129.5,25.38 129.5,23.09 116.7,10.29 116.7,8.69 115.67,7.66 X1.27
X27
  Bottom 0.254: IC4.12 137.16,25.38 136.7,25.38 130.76,19.43 124.93,19.43 115.67,10.17 X1.28
X28
  Top 0.254: IC4.1 126.99,17.72 126.64,17.72 119.22,10.29 119.22,8.69 118.19,7.66 X1.29
X29
  Bottom 0.254: IC4.5 137.16,17.49 130.99,11.32 127.79,11.32 126.87,10.4 126.87,9.72 126.19,9.03 119.22,9.03 118.19,10.06 X1.30
X30
  Top 0.254: IC4.2 129.5,17.72 129.5,9.83 128.47,8.8 122.53,8.8 121.39,7.66 120.7,7.66 X1.31
X31
  Bottom 0.254: IC4.4 134.53,17.72 134.19,17.72 128.7,12.23 122.76,12.23 120.7,10.17 X1.32
X32
  Bottom 0.254: IC5.13 116.93,43.09 116.93,41.6 117.27,41.26 117.27,38.06 115.33,36.12 115.33,23.32 112.81,20.8 112.81,11.54 111.9,10.63 111.9,9.72 112.81,8.8 118.53,8.8 119.56,7.77 119.56,7.09 120.13,6.51 122.07,6.51 123.1,7.54 X1.33
X33
  Top 0.254: IC5.14 114.3,40.69 113.84,40.23 113.84,38.18 115.56,36.46 115.56,11.77 114.41,10.63 114.41,7.2 115.1,6.51 118.64,6.51 119.56,7.43 119.56,8.12 120.47,9.03 122.07,9.03 123.1,10.06 X1.34
X34  (via drill 0.61)
  Top 0.254: v134.42,10.4 135.67,11.66 135.67,36.58 123.67,48.58 116.93,48.58 111.78,43.43 111.78,43.2 IC5.15
  Bottom 0.254: v134.42,10.4 132.59,10.4 130.99,8.8 126.87,8.8 125.73,7.66 X1.35
X35
  Bottom 0.254: IC5.12 119.44,43.2 119.79,43.2 121.5,44.92 133.04,44.92 145.85,32.12 145.85,24.35 140.93,19.43 136.7,19.43 135.67,18.4 135.67,16.69 130.76,11.77 127.33,11.77 125.73,10.17 X1.36
X36  (via drill 0.61)
  Top 0.254: v113.73,47.32 110.76,44.35 110.76,42.63 109.27,41.15 109.27,35.66 IC5.1 | v123.9,45.83 125.96,43.78 125.96,33.6 133.16,26.4 133.16,21.03 130.99,18.86 130.99,11.54 131.9,10.63 131.9,9.72 130.99,8.8 129.5,8.8 128.36,7.66 X1.37
  Bottom 0.254: v113.73,47.32 122.42,47.32 v123.9,45.83
X37
  Top 0.254: IC5.5 119.44,35.55 119.44,35.2 127.56,27.09 129.96,27.09 130.53,26.52 130.53,20.92 128.36,18.75 128.36,10.17 X1.38
X38  (via drill 0.61)
  Top 0.254: v110.41,11.66 109.39,10.63 v109.39,9.14
  Bottom 0.254: v110.41,11.66 110.41,26.18 111.67,27.43 111.67,35.55 IC5.2 | v109.39,9.14 109.96,9.14 110.3,8.8 110.87,8.8 111.9,7.77 111.9,7.2 113.04,6.06 129.27,6.06 130.76,7.54 X1.39
X39
  Top 0.254: IC5.4 116.93,35.66 117.39,35.66 118.99,37.26 119.79,37.26 120.93,36.12 120.93,34.4 127.79,27.55 130.19,27.55 130.99,26.75 130.99,19.55 130.53,19.09 130.53,10.4 130.76,10.17 X1.40